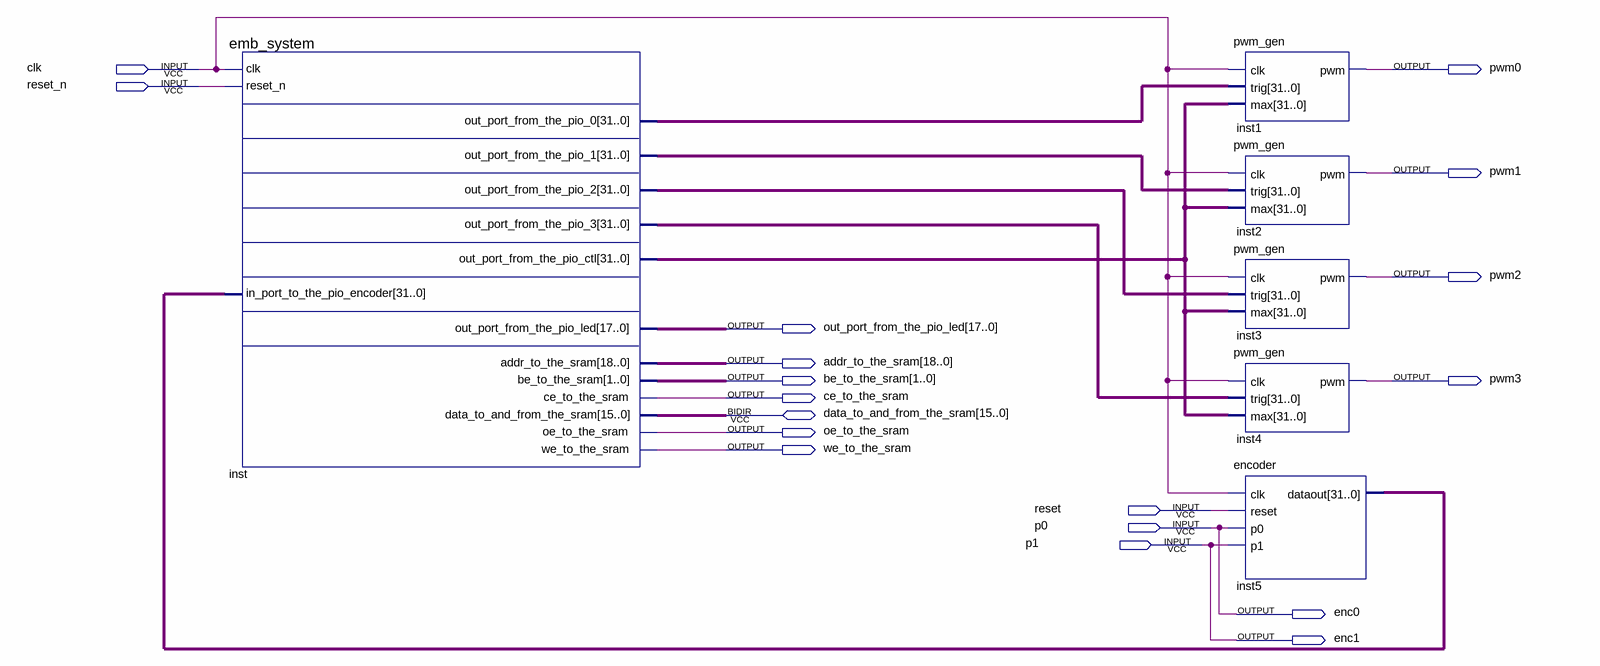
[diagram p0: schematic sheet]
// Quartus schematic RobotIF.bdf as structural Verilog: 6 symbols, 18 pins
module RobotIF (
  input  clk,
  input  reset_n,
  input  reset,
  input  p0,
  input  p1,
  inout  [15:0] data_to_and_from_the_sram,
  output pwm0,
  output pwm1,
  output pwm2,
  output [17:0] out_port_from_the_pio_led,
  output [18:0] addr_to_the_sram,
  output [1:0] be_to_the_sram,
  output pwm3,
  output ce_to_the_sram,
  output oe_to_the_sram,
  output we_to_the_sram,
  output enc0,
  output enc1
);

  wire [31:0] inst5_dataout, inst_out_port_from_the_pio_0, inst_out_port_from_the_pio_1,
       inst_out_port_from_the_pio_2, inst_out_port_from_the_pio_3, inst_out_port_from_the_pio_ctl;

  emb_system inst (
    .clk(clk), .reset_n(reset_n), .in_port_to_the_pio_encoder(inst5_dataout),
    .out_port_from_the_pio_0(inst_out_port_from_the_pio_0),
    .out_port_from_the_pio_1(inst_out_port_from_the_pio_1),
    .out_port_from_the_pio_2(inst_out_port_from_the_pio_2),
    .out_port_from_the_pio_3(inst_out_port_from_the_pio_3),
    .out_port_from_the_pio_ctl(inst_out_port_from_the_pio_ctl),
    .out_port_from_the_pio_led(out_port_from_the_pio_led), .addr_to_the_sram(addr_to_the_sram),
    .be_to_the_sram(be_to_the_sram), .ce_to_the_sram(ce_to_the_sram), .oe_to_the_sram(oe_to_the_sram),
    .we_to_the_sram(we_to_the_sram), .data_to_and_from_the_sram(data_to_and_from_the_sram));
  pwm_gen inst1 (.clk(clk), .trig(inst_out_port_from_the_pio_0), .max(inst_out_port_from_the_pio_ctl), .pwm(pwm0));
  pwm_gen inst2 (.clk(clk), .trig(inst_out_port_from_the_pio_1), .max(inst_out_port_from_the_pio_ctl), .pwm(pwm1));
  pwm_gen inst3 (.clk(clk), .trig(inst_out_port_from_the_pio_2), .max(inst_out_port_from_the_pio_ctl), .pwm(pwm2));
  pwm_gen inst4 (.clk(clk), .trig(inst_out_port_from_the_pio_3), .max(inst_out_port_from_the_pio_ctl), .pwm(pwm3));
  encoder inst5 (.clk(clk), .reset(reset), .p0(p0), .p1(p1), .dataout(inst5_dataout));

  assign enc0 = p0;
  assign enc1 = p1;
endmodule
